# Altium schematic sheet Power Supply.SchDoc
size A4
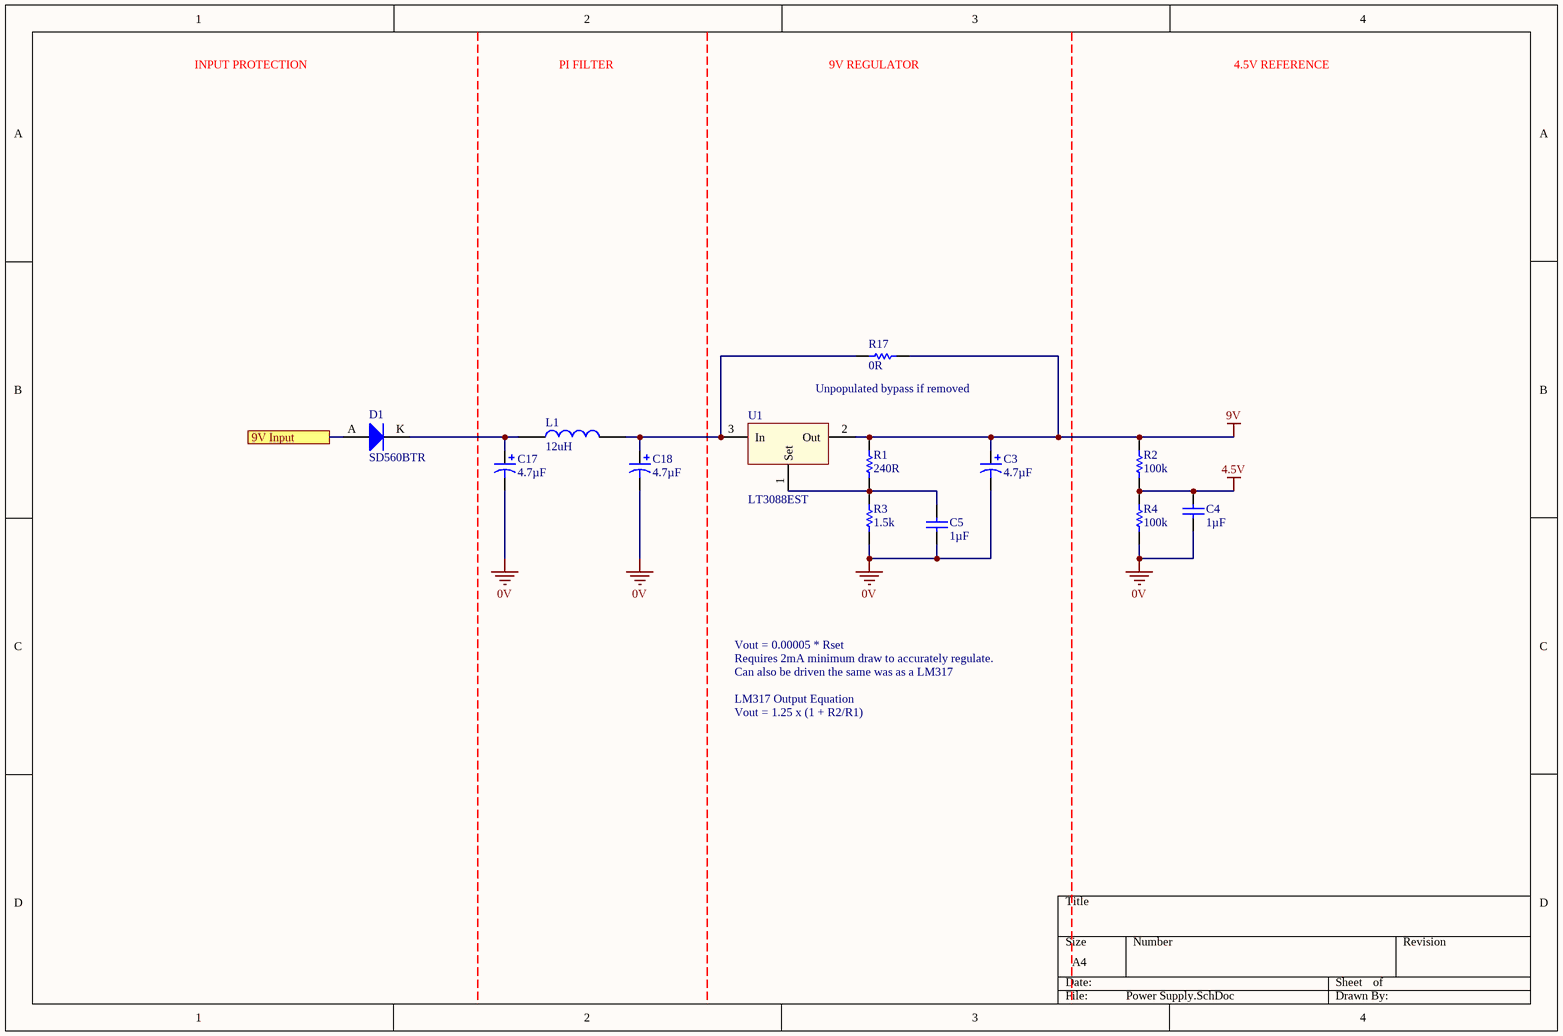
[diagram p0: Power Supply.SchDoc]

## Parts
C3  4.7µF  [1206]
C4  1µF  [0805]
C5  1µF  [0805]
C17  4.7µF  [1206]
C18  4.7µF  [1206]
D1  SD560BTR  [SMB Diode]
L1  12uH  [1812]
R1  240R  [0805]
R2  100k  [0805]
R3  1.5k  [0805]
R4  100k  [0805]
R17  0R  [0805]
U1  LT3088EST  [LT SOT-223]

## Ports
9V Input

## Nets
0V: C3.1 C4.1 C5.1 C17.1 C18.1 R3.1 R4.1
4.5V: C4.2 R2.1 R4.2
9V: C3.2 R1.2 R2.2 R17.2 U1.2(Out)
9V Input: D1.A ; port 9V Input
NetC5_2: C5.2 R1.1 R3.2 U1.1(Set)
NetC17_2: C17.2 D1.K L1.2
NetC18_2: C18.2 L1.1 R17.1 U1.3(In)

## Notes on the sheet
- INPUT PROTECTION
- PI FILTER
- 9V REGULATOR
- 4.5V REFERENCE
- Unpopulated bypass if removed
- Vout = 0.00005 * Rset
- LM317 Output Equation
- Vout = 1.25 x (1 + R2/R1)
- Can also be driven the same was as a LM317
- Requires 2mA minimum draw to accurately regulate.

## Library data of the parts
C3 C17 C18 = TAJA475K025RNJ: Manufacturer: AVX Corporation; Tolerance: ±10%; Material: Tantalum; Rated Voltage: 25V; Part Number: TAJA475K025RNJ; Value: 4.7µF; Digikey Part Number: 478-11053-1-ND
C4 C5 = GCM21BR71H105KA03L: Manufacturer: muRata; Tolerance: ±10%; Material: X7R; Rated Voltage: 50V; Part Number: GCM21BR71H105KA03L; Value: 1µF; Digikey Part Number: 490-10675-1-ND
D1 = SD560BTR: 1.2V_F 600V 5A SMB; Manufacturer: SMC Diode Solutions; Part Number: SD560BTR; Digikey Part Number: 1655-1530-2-ND; Digikey Link: https://www.digikey.com/product-detail/en/smc-diode-solutions/SD560BTR/1655-1530-2-ND/6022620
L1 = RLS-126: Manufacturer: Recom; Impedence: 230mOhm; Tolerance: 0.2; Material: Wirewound; Rated Current: 800mA; Part Number: RLS-126; Value: 12uH; Digikey Part Number: 945-3429-ND
R1 = RC0805FR07240RL: Manufacturer: YAGEO; Tolerance: 0.01; Rated Voltage: 0.125W; Part Number: RC0805FR07240RL; Value: 240R; Material: FR-07; Digikey Part Number: 311-240CRCT-ND
R2 R4 = RC0805FR07100KL: Manufacturer: YAGEO; Tolerance: 0.01; Rated Voltage: 0.125W; Part Number: RC0805FR07100KL; Value: 100k; Material: FR-07; Digikey Part Number: 311-100KCRCT-ND
R3 = RC0805FR071K5L: Manufacturer: YAGEO; Tolerance: 0.01; Rated Voltage: 0.125W; Part Number: RC0805FR071K5L; Value: 1.5k; Material: FR-07; Digikey Part Number: 311-1.50KCRCT-ND
R17 = RC0805FR070RL: Manufacturer: YAGEO; Tolerance: 0.01; Rated Voltage: 0.125W; Part Number: RC0805FR070RL; Value: 0R; Material: FR-07; Digikey Part Number: 311-0.0CRCT-ND
U1 = LT3088EST: Linear Voltage Regulator IC Output 800mA SOT-223-3; Manufacturer: Linear Technologies; Input Voltage: 1.6V-36V; Output Voltage: 1.6V-34.5V; Efficiency: 0.5; Isolation: Non-Isolated; Part Number: LT3088EST; Output Power: 800mA; Digikey Part Number: LT3088EST#PBF-ND; Digikey Link: https://www.digikey.com/en/products/detail/analog-devices-inc/LT3088EST-PBF/5297582